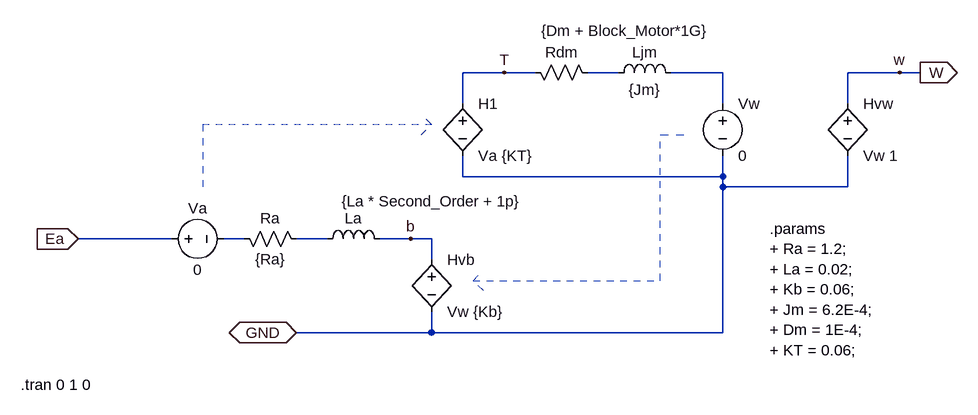
[diagram p0: schematic DC_Motor.asc]
DC_Motor.asc, the LTspice schematic file:
Version 4
SHEET 1 2676 1700
WIRE 944 288 880 288
WIRE 992 288 944 288
WIRE 1120 288 1072 288
WIRE 1280 288 1200 288
WIRE 1552 288 1472 288
WIRE 1584 288 1552 288
WIRE 880 336 880 288
WIRE 1280 336 1280 288
WIRE 1472 336 1472 288
WIRE 880 448 880 416
WIRE 1280 448 1280 416
WIRE 1280 448 880 448
WIRE 1280 464 1280 448
WIRE 1472 464 1472 416
WIRE 1472 464 1280 464
WIRE 432 544 288 544
WIRE 544 544 512 544
WIRE 672 544 624 544
WIRE 800 544 752 544
WIRE 832 544 800 544
WIRE 832 576 832 544
WIRE 832 688 832 656
WIRE 832 688 624 688
WIRE 1280 688 1280 464
WIRE 1280 688 832 688
FLAG 800 544 b
FLAG 944 288 T
FLAG 1552 288 w
FLAG 288 544 Ea
IOPIN 288 544 In
FLAG 1584 288 W
IOPIN 1584 288 Out
FLAG 624 688 GND
IOPIN 624 688 BiDir
SYMBOL ind 768 560 M270
WINDOW 0 32 56 VTop 2
WINDOW 3 74 74 VLeft 2
SYMATTR InstName La
SYMATTR Value {La * Second_Order + 1p}
SYMATTR SpiceLine Rser=1n
SYMBOL res 528 528 M90
WINDOW 0 0 56 VBottom 2
WINDOW 3 32 56 VTop 2
SYMATTR InstName Ra
SYMATTR Value {Ra}
SYMBOL h 880 320 R0
SYMATTR InstName H1
SYMATTR Value Va {KT}
SYMBOL ind 1216 304 M270
WINDOW 0 32 56 VTop 2
WINDOW 3 5 56 VBottom 2
SYMATTR InstName Ljm
SYMATTR Value {Jm}
SYMATTR SpiceLine Rser=1n
SYMBOL res 976 272 M90
WINDOW 0 0 56 VBottom 2
WINDOW 3 -48 25 VRight 2
SYMATTR InstName Rdm
SYMATTR Value {Dm + Block_Motor*1G}
SYMBOL h 832 560 R0
SYMATTR InstName Hvb
SYMATTR Value Vw {Kb}
SYMBOL voltage 1280 320 R0
SYMATTR InstName Vw
SYMATTR Value 0
SYMBOL voltage 416 544 M90
WINDOW 0 -32 56 VBottom 2
WINDOW 3 32 56 VTop 2
SYMATTR InstName Va
SYMATTR Value 0
SYMBOL h 1472 320 R0
SYMATTR InstName Hvw
SYMATTR Value Vw 1
TEXT 1352 528 Left 2 !.params\n+ Ra = 1.2;\n+ La = 0.02;\n+ Kb = 0.06;\n+ Jm = 6.2E-4;\n+ Dm = 1E-4;\n+ KT = 0.06;
TEXT 200 768 Left 2 !.tran 0 1 0
LINE Normal 480 368 480 464 2
LINE Normal 832 368 480 368 2
LINE Normal 832 368 816 352 2
LINE Normal 816 384 832 368 2
LINE Normal 1184 384 1232 384 2
LINE Normal 1184 608 1184 384 2
LINE Normal 896 608 1184 608 2
LINE Normal 896 608 912 592 2
LINE Normal 912 624 896 608 2

The netlist it stands for:
* DC_Motor.asc
La b N004 {La * Second_Order + 1p} Rser=1n
Ra N003 N004 {Ra}
H1 T GND Va {KT}
Ljm N002 N001 {Jm} Rser=1n
Rdm T N001 {Dm + Block_Motor*1G}
Hvb b GND Vw {Kb}
Vw N002 GND 0
Va Ea N003 0
Hvw w GND Vw 1
.params
+ Ra = 1.2;
+ La = 0.02;
+ Kb = 0.06;
+ Jm = 6.2E-4;
+ Dm = 1E-4;
+ KT = 0.06;
.tran 0 1 0
.backanno
.end